# EAGLE design main_board (EAGLE 9.0.0)
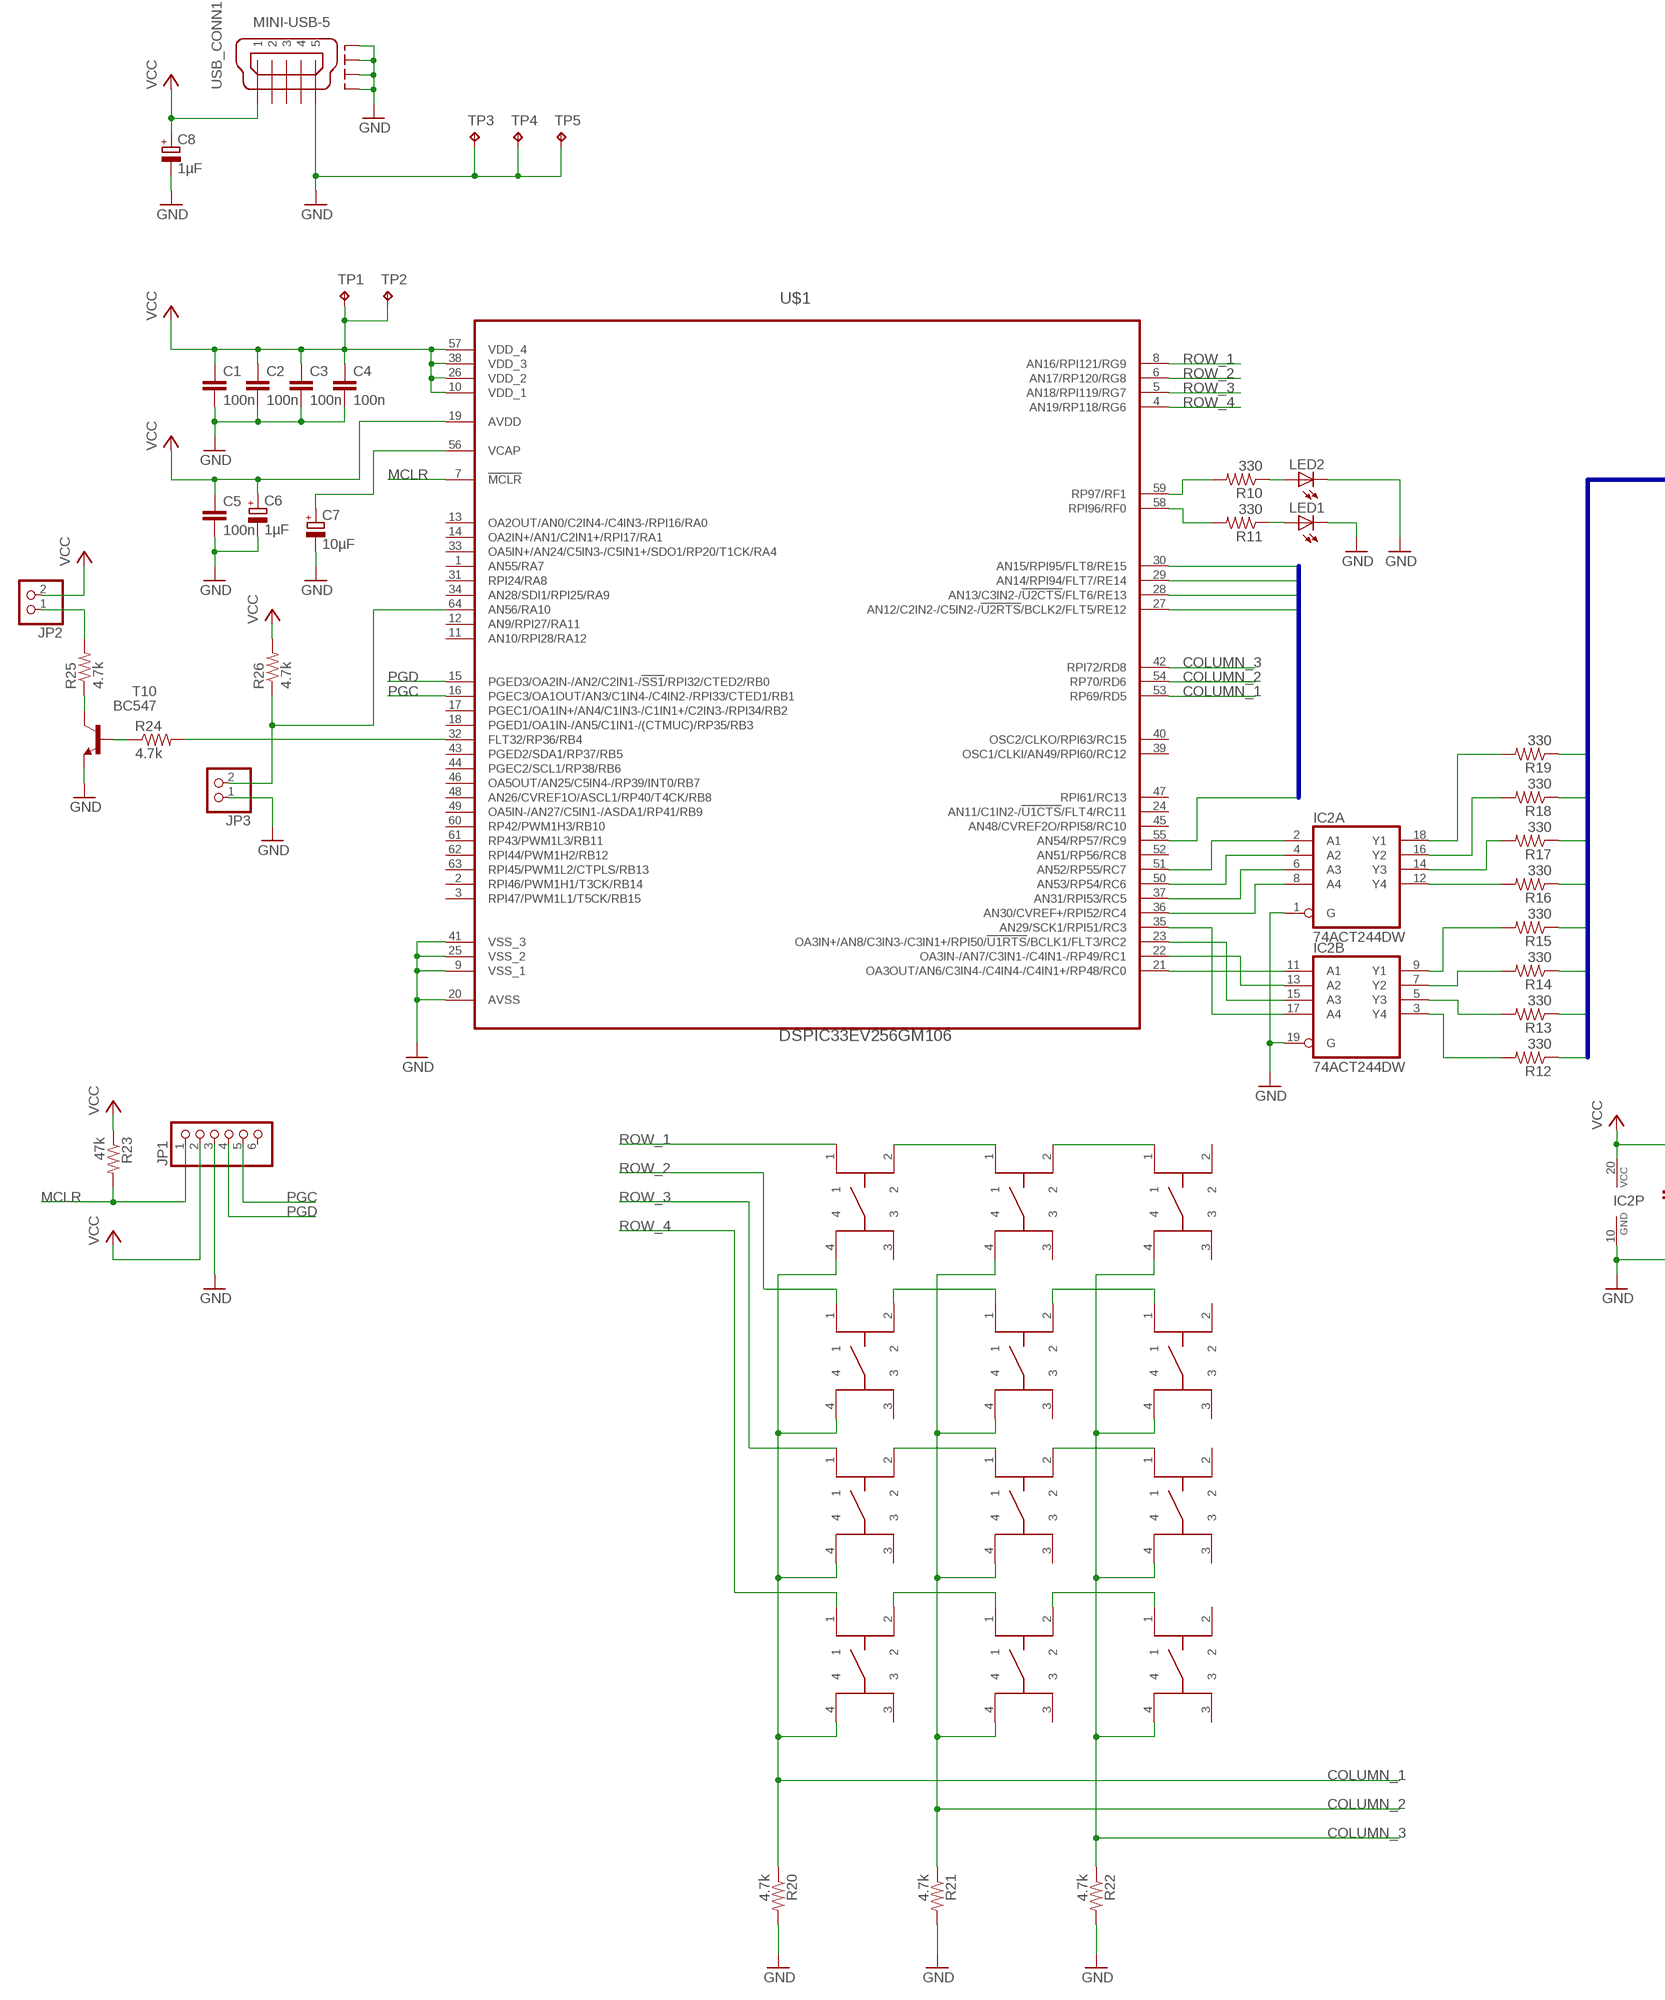
[diagram p0: schematic, sheet 1, part 1 of 2]
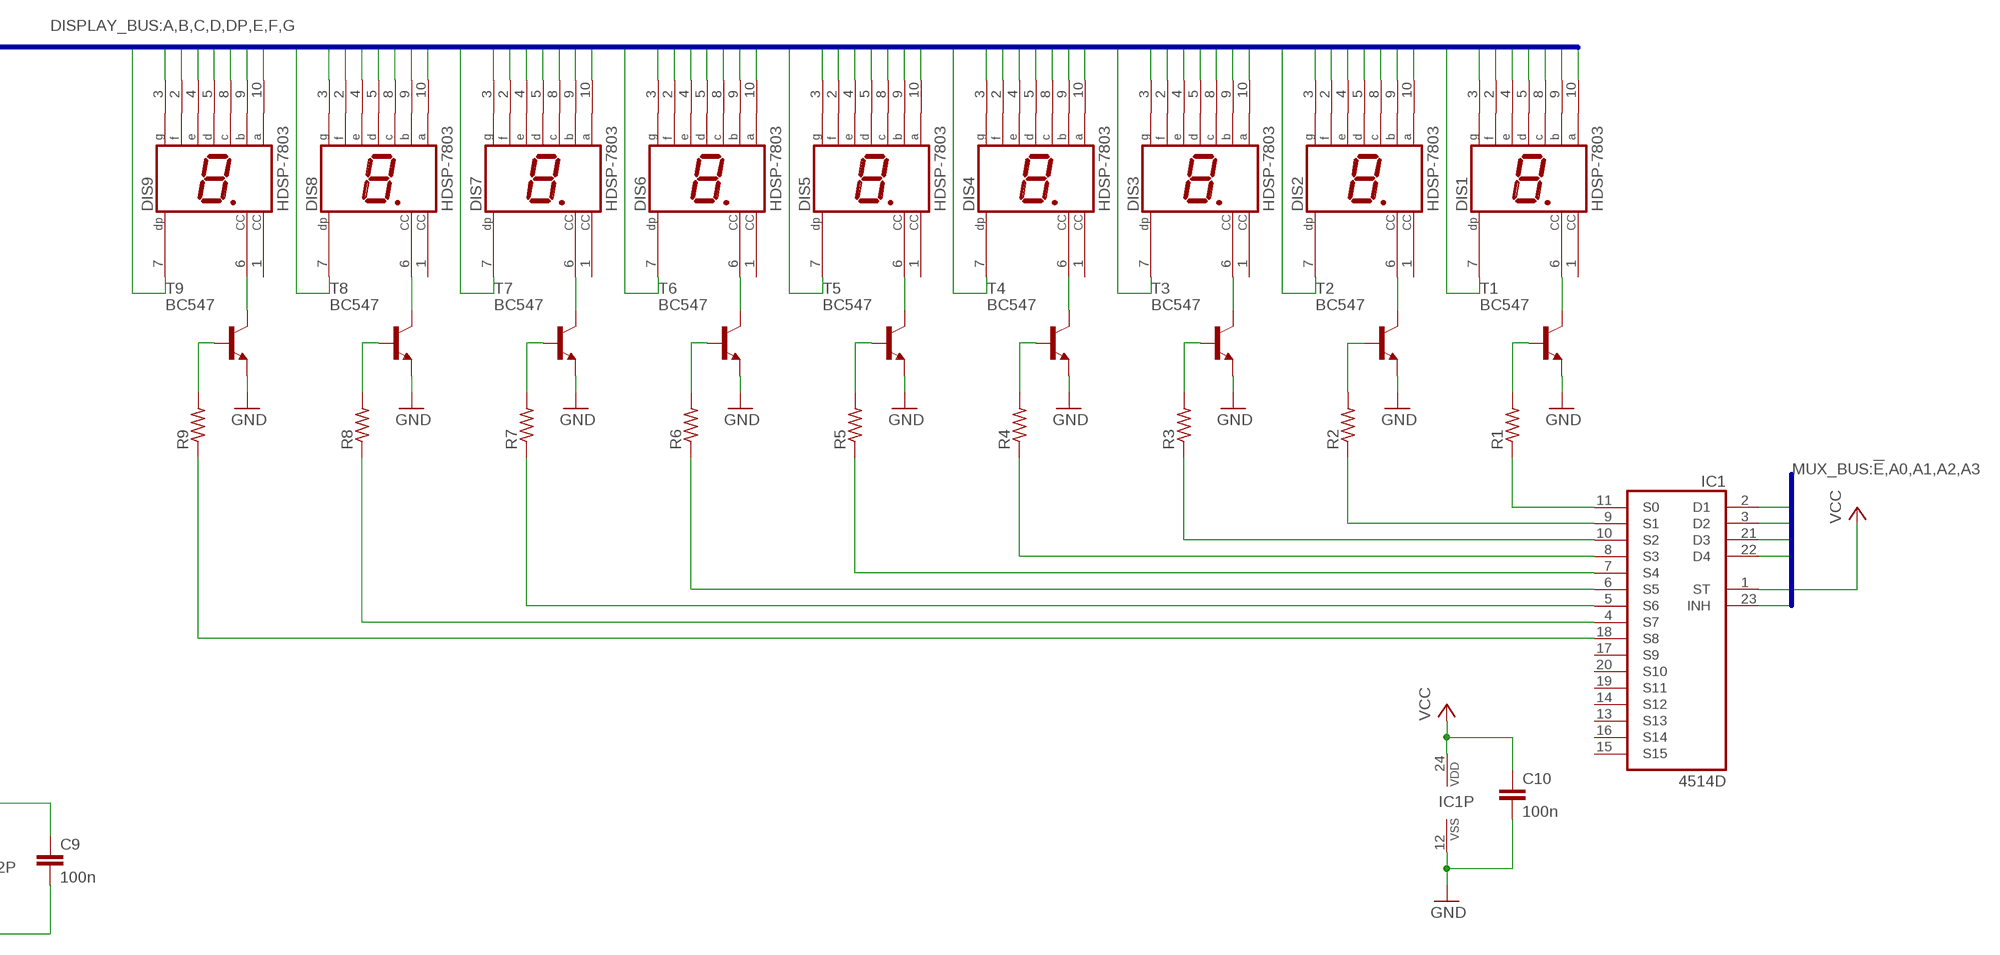
[diagram p1: schematic, sheet 1, part 2 of 2]

## Parts
B1  KSC521G  [KSC521G]
B2  KSC521G  [KSC521G]
B3  KSC521G  [KSC521G]
B4  KSC521G  [KSC521G]
B5  KSC521G  [KSC521G]
B6  KSC521G  [KSC521G]
B7  KSC521G  [KSC521G]
B8  KSC521G  [KSC521G]
B9  KSC521G  [KSC521G]
B10  KSC521G  [KSC521G]
B11  KSC521G  [KSC521G]
B12  KSC521G  [KSC521G]
C1  100n  C-EU050-025X075  [C050-025X075]
C2  100n  C-EU050-025X075  [C050-025X075]
C3  100n  C-EU050-025X075  [C050-025X075]
C4  100n  C-EU050-025X075  [C050-025X075]
C5  100n  C-EU050-025X075  [C050-025X075]
C6  1µF  CPOL-EUE2.5-7  [E2,5-7]
C7  10µF  CPOL-EUE2.5-7  [E2,5-7]
C8  1µF  CPOL-EUE2.5-7  [E2,5-7]
C9  100n  C-EU050-025X075  [C050-025X075]
C10  100n  C-EU050-025X075  [C050-025X075]
DIS1  HDSP-7803  [HDSP-A]
DIS2  HDSP-7803  [HDSP-A]
DIS3  HDSP-7803  [HDSP-A]
DIS4  HDSP-7803  [HDSP-A]
DIS5  HDSP-7803  [HDSP-A]
DIS6  HDSP-7803  [HDSP-A]
DIS7  HDSP-7803  [HDSP-A]
DIS8  HDSP-7803  [HDSP-A]
DIS9  HDSP-7803  [HDSP-A]
IC1  4514D  [SO24W]
IC2  74ACT244DW  [SO20W]
JP1  PINHD-1X6  [1X06]
JP2  PINHD-1X2  [1X02]
JP3  PINHD-1X2  [1X02]
LED1  LED5MM  [LED5MM]
LED2  LED5MM  [LED5MM]
R1  R-US_0207/10  [0207/10]
R2  R-US_0207/10  [0207/10]
R3  R-US_0207/10  [0207/10]
R4  R-US_0207/10  [0207/10]
R5  R-US_0207/10  [0207/10]
R6  R-US_0207/10  [0207/10]
R7  R-US_0207/10  [0207/10]
R8  R-US_0207/10  [0207/10]
R9  R-US_0207/10  [0207/10]
R10  330  R-US_0207/10  [0207/10]
R11  330  R-US_0207/10  [0207/10]
R12  330  R-US_0207/10  [0207/10]
R13  330  R-US_0207/10  [0207/10]
R14  330  R-US_0207/10  [0207/10]
R15  330  R-US_0207/10  [0207/10]
R16  330  R-US_0207/10  [0207/10]
R17  330  R-US_0207/10  [0207/10]
R18  330  R-US_0207/10  [0207/10]
R19  330  R-US_0207/10  [0207/10]
R20  4.7k  R-US_0207/10  [0207/10]
R21  4.7k  R-US_0207/10  [0207/10]
R22  4.7k  R-US_0207/10  [0207/10]
R23  47k  R-US_0207/10  [0207/10]
R24  4.7k  R-US_0207/10  [0207/10]
R25  4.7k  R-US_0207/10  [0207/10]
R26  4.7k  R-US_0207/10  [0207/10]
T1  BC547  [TO92]
T2  BC547  [TO92]
T3  BC547  [TO92]
T4  BC547  [TO92]
T5  BC547  [TO92]
T6  BC547  [TO92]
T7  BC547  [TO92]
T8  BC547  [TO92]
T9  BC547  [TO92]
T10  BC547  [TO92]
TP1  TPTP12SQ  [TP12SQ]
TP2  TPTP12SQ  [TP12SQ]
TP3  TPTP12SQ  [TP12SQ]
TP4  TPTP12SQ  [TP12SQ]
TP5  TPTP12SQ  [TP12SQ]
U$1  DSPIC33EV256GM106  [TQFP64-10X10]
USB_CONN1  MINI-USB-5  [56579-0579]

## Nets
!E: IC1.23(INH) U$1.55(AN54/RP57/RC9)
A: DIS1.10(A) DIS2.10(A) DIS3.10(A) DIS4.10(A) DIS5.10(A) DIS6.10(A) DIS7.10(A) DIS8.10(A) DIS9.10(A) R12.1
A0: IC1.2(D1) U$1.27(AN12/C2IN2-/C5IN2-/!U2RTS!/BCLK2/FLT5/RE12)
A1: IC1.3(D2) U$1.28(AN13/C3IN2-/!U2CTS!/FLT6/RE13)
A2: IC1.21(D3) U$1.29(AN14/RPI94/FLT7/RE14)
A3: IC1.22(D4) U$1.30(AN15/RPI95/FLT8/RE15)
B: DIS1.9(B) DIS2.9(B) DIS3.9(B) DIS4.9(B) DIS5.9(B) DIS6.9(B) DIS7.9(B) DIS8.9(B) DIS9.9(B) R13.1
C: DIS1.8(C) DIS2.8(C) DIS3.8(C) DIS4.8(C) DIS5.8(C) DIS6.8(C) DIS7.8(C) DIS8.8(C) DIS9.8(C) R14.1
COLUMN_1: B1.4 B4.4 B7.4 B11.4 R20.1 U$1.53(RP69/RD5)
COLUMN_2: B2.4 B5.4 B8.4 B10.4 R21.1 U$1.54(RP70/RD6)
COLUMN_3: B3.4 B6.4 B9.4 B12.4 R22.1 U$1.42(RPI72/RD8)
D: DIS1.5(D) DIS2.5(D) DIS3.5(D) DIS4.5(D) DIS5.5(D) DIS6.5(D) DIS7.5(D) DIS8.5(D) DIS9.5(D) R15.1
DP: DIS1.7(DP) DIS2.7(DP) DIS3.7(DP) DIS4.7(DP) DIS5.7(DP) DIS6.7(DP) DIS7.7(DP) DIS8.7(DP) DIS9.7(DP) R19.1
E: DIS1.4(E) DIS2.4(E) DIS3.4(E) DIS4.4(E) DIS5.4(E) DIS6.4(E) DIS7.4(E) DIS8.4(E) DIS9.4(E) R16.1
F: DIS1.2(F) DIS2.2(F) DIS3.2(F) DIS4.2(F) DIS5.2(F) DIS6.2(F) DIS7.2(F) DIS8.2(F) DIS9.2(F) R17.1
G: DIS1.3(G) DIS2.3(G) DIS3.3(G) DIS4.3(G) DIS5.3(G) DIS6.3(G) DIS7.3(G) DIS8.3(G) DIS9.3(G) R18.1
GND: C1.2 C2.2 C3.2 C4.2 C5.2 C6.- C7.- C8.- C9.2 C10.2 IC1.12(VSS) IC2.1(A:G) IC2.10(P:GND) IC2.19(B:G) JP1.3 JP3.1 LED1.K(C) LED2.K(C) R20.2 R21.2 R22.2 T1.1(E) T2.1(E) T3.1(E) T4.1(E) T5.1(E) T6.1(E) T7.1(E) T8.1(E) T9.1(E) T10.1(E) TP3.TP TP4.TP TP5.TP U$1.9(VSS_1) U$1.20(AVSS) U$1.25(VSS_2) U$1.41(VSS_3) USB_CONN1.GND USB_CONN1.SHIELD@1(S1) USB_CONN1.SHIELD@2(S2) USB_CONN1.SHIELD@3(S3) USB_CONN1.SHIELD@4(S4)
MCLR: JP1.1 R23.2 U$1.7(!MCLR)
N$1: DIS9.6(CC) T9.3(C)
N$2: C7.+ U$1.56(VCAP)
N$3: DIS8.6(CC) T8.3(C)
N$4: DIS7.6(CC) T7.3(C)
N$5: DIS6.6(CC) T6.3(C)
N$6: DIS5.6(CC) T5.3(C)
N$7: DIS4.6(CC) T4.3(C)
N$8: DIS3.6(CC) T3.3(C)
N$9: DIS2.6(CC) T2.3(C)
N$10: DIS1.6(CC) T1.3(C)
N$11: R1.2 T1.2(B)
N$12: R2.2 T2.2(B)
N$13: R3.2 T3.2(B)
N$14: R4.2 T4.2(B)
N$15: R5.2 T5.2(B)
N$16: R6.2 T6.2(B)
N$17: R7.2 T7.2(B)
N$18: R8.2 T8.2(B)
N$19: R9.2 T9.2(B)
N$20: IC1.11(S0) R1.1
N$21: IC1.9(S1) R2.1
N$22: IC1.10(S2) R3.1
N$23: IC1.8(S3) R4.1
N$24: IC1.7(S4) R5.1
N$25: IC1.6(S5) R6.1
N$26: IC1.5(S6) R7.1
N$27: IC1.4(S7) R8.1
N$28: IC1.18(S8) R9.1
N$29: R10.2 U$1.59(RP97/RF1)
N$30: IC2.3(B:Y4) R12.2
N$31: LED1.A R11.1
N$32: R11.2 U$1.58(RPI96/RF0)
N$33: LED2.A R10.1
N$34: IC2.17(B:A4) U$1.35(AN29/SCK1/RPI51/RC3)
N$35: IC2.15(B:A3) U$1.23(OA3IN+/AN8/C3IN3-/C3IN1+/RPI50/!U1RTS!/BCLK1/FLT3/RC2)
N$36: IC2.13(B:A2) U$1.22(OA3IN-/AN7/C3IN1-/C4IN1-/RP49/RC1)
N$37: IC2.11(B:A1) U$1.21(OA3OUT/AN6/C3IN4-/C4IN4-/C4IN1+/RP48/RC0)
N$38: IC2.8(A:A4) U$1.36(AN30/CVREF+/RPI52/RC4)
N$39: IC2.6(A:A3) U$1.37(AN31/RPI53/RC5)
N$40: IC2.4(A:A2) U$1.50(AN53/RP54/RC6)
N$41: IC2.2(A:A1) U$1.51(AN52/RP55/RC7)
N$42: IC2.5(B:Y3) R13.2
N$43: IC2.7(B:Y2) R14.2
N$44: IC2.9(B:Y1) R15.2
N$45: IC2.12(A:Y4) R16.2
N$46: IC2.14(A:Y3) R17.2
N$47: IC2.16(A:Y2) R18.2
N$48: IC2.18(A:Y1) R19.2
N$49: JP3.2 R26.1 U$1.64(AN56/RA10)
N$50: R24.1 T10.2(B)
N$51: R25.1 T10.3(C)
N$52: R24.2 U$1.32(FLT32/RP36/RB4)
N$53: JP2.1 R25.2
N$54: B7.2 B8.1
N$55: B1.2 B2.1
N$56: B2.2 B3.1
N$57: B4.2 B5.1
N$58: B5.2 B6.1
N$59: B8.2 B9.1
N$60: B10.1 B11.2
N$61: B10.2 B12.1
PGC: JP1.5 U$1.16(PGEC3/OA1OUT/AN3/C1IN4-/C4IN2-/RPI33/CTED1/RB1)
PGD: JP1.4 U$1.15(PGED3/OA2IN-/AN2/C2IN1-/!SS1!/RPI32/CTED2/RB0)
ROW_1: B1.1 U$1.8(AN16/RPI121/RG9)
ROW_2: B4.1 U$1.6(AN17/RP120/RG8)
ROW_3: B7.1 U$1.5(AN18/RPI119/RG7)
ROW_4: B11.1 U$1.4(AN19/RP118/RG6)
VCC: C1.1 C2.1 C3.1 C4.1 C5.1 C6.+ C8.+ C9.1 C10.1 IC1.1(ST) IC1.24(VDD) IC2.20(P:VCC) JP1.2 JP2.2 R23.1 R26.2 TP1.TP TP2.TP U$1.10(VDD_1) U$1.19(AVDD) U$1.26(VDD_2) U$1.38(VDD_3) U$1.57(VDD_4) USB_CONN1.VBUS
Unconnected: B1.3 B2.3 B3.2 B3.3 B4.3 B5.3 B6.2 B6.3 B7.3 B8.3 B9.2 B9.3 B10.3 B11.3 B12.2 B12.3 DIS1.1(CC) DIS2.1(CC) DIS3.1(CC) DIS4.1(CC) DIS5.1(CC) DIS6.1(CC) DIS7.1(CC) DIS8.1(CC) DIS9.1(CC) IC1.13(S13) IC1.14(S12) IC1.15(S15) IC1.16(S14) IC1.17(S9) IC1.19(S11) IC1.20(S10) JP1.6 U$1.1(AN55/RA7) U$1.2(RPI46/PWM1H1/T3CK/RB14) U$1.3(RPI47/PWM1L1/T5CK/RB15) U$1.11(AN10/RPI28/RA12) U$1.12(AN9/RPI27/RA11) U$1.13(OA2OUT/AN0/C2IN4-/C4IN3-/RPI16/RA0) U$1.14(OA2IN+/AN1/C2IN1+/RPI17/RA1) U$1.17(PGEC1/OA1IN+/AN4/C1IN3-/C1IN1+/C2IN3-/RPI34/RB2) U$1.18(PGED1/OA1IN-/AN5/C1IN1-/(CTMUC)/RP35/RB3) U$1.24(AN11/C1IN2-/!U1CTS!/FLT4/RC11) U$1.31(RPI24/RA8) U$1.33(OA5IN+/AN24/C5IN3-/C5IN1+/SDO1/RP20/T1CK/RA4) U$1.34(AN28/SDI1/RPI25/RA9) U$1.39(OSC1/CLKI/AN49/RPI60/RC12) U$1.40(OSC2/CLKO/RPI63/RC15) U$1.43(PGED2/SDA1/RP37/RB5) U$1.44(PGEC2/SCL1/RP38/RB6) U$1.45(AN48/CVREF2O/RPI58/RC10) U$1.46(OA5OUT/AN25/C5IN4-/RP39/INT0/RB7) U$1.47(RPI61/RC13) U$1.48(AN26/CVREF1O/ASCL1/RP40/T4CK/RB8) U$1.49(OA5IN-/AN27/C5IN1-/ASDA1/RP41/RB9) U$1.52(AN51/RP56/RC8) U$1.60(RP42/PWM1H3/RB10) U$1.61(RP43/PWM1L3/RB11) U$1.62(RPI44/PWM1H2/RB12) U$1.63(RPI45/PWM1L2/CTPLS/RB13) USB_CONN1.DN USB_CONN1.DP USB_CONN1.NC

## Buses
DISPLAY_BUS:A,B,C,D,DP,E,F,G
MUX_BUS:!E,A0,A1,A2,A3

## Library data of the parts
B1-B12 = qb_lib:KSC521G: KSC521G Boutton poussoir de C&K COMPONENTS. Référence Farnell : 2845724
C1-C5 C9 C10 = rcl:C-EU: CAPACITOR, European symbol; SPICEPREFIX: C
C6-C8 = rcl:CPOL-EU: POLARIZED CAPACITOR, European symbol; SPICEPREFIX: C
DIS1-DIS9 = qb_lib:HDSP-7803: LED DISPLAY 1-character 7 segment, decimal point right; OC_FARNELL: unknown; OC_NEWARK: unknown
IC1 = 45xx:4514: 4-bit latch 4-16 line DECODER
IC2 = 74xx-eu:74*244: Octal BUFFER and LINE DRIVER, 3-state
JP1 = pinhead:PINHD-1X6: PIN HEADER
JP2 JP3 = pinhead:PINHD-1X2: PIN HEADER
LED1 LED2 = led:LED: LED OSRAM: - CHIPLED LG R971, LG N971, LY N971, LG Q971, LY Q971, LO R971, LY R971 LH N974, LH R974 LS Q976, LO Q976, LY Q976 LO Q996 - Hyper CHIPLED LW Q18S LB Q993, LB Q99A, LB R99A - SideLED LS A670, LO A670, LY A670, LG A670, LP A670 LB A673, LV A673, LT A673, LW A673 LH A674 LY A675 LS A676, LA A676, LO A676, LY A676, LW A676 LS A679, LY A679, LG A679 - Hyper Micro SIDELED® LS Y876, LA Y876, LO Y876, LY Y876 LT Y87S - SmartLED LW L88C, LW L88S LB L89C, LB L89S, LG L890 LS L89K, LO L89K, LY L89K LS L896, LA L896, LO L896, LY L896 - TOPLED LS T670, LO T670, LY T670, LG T670, LP T670 LSG T670, LSP T670, LSY T670, LOP T670, LYG T670 LG T671, LOG T671, LSG T671 LB T673, LV T673, LT T673, LW T673 LH T674 LS T676, LA T676, LO T676, LY T676, LB T676, LH T676, LSB T676, LW T676 LB T67C, LV T67C, LT T67C, LS T67K, LO T67K, LY T67K, LW E67C LS E67B, LA E67B, LO E67B, LY E67B, LB E67C, LV E67C, LT E67C LW T67C LS T679, LY T679, LG T679 LS T770, LO T770, LY T770, LG T770, LP T770 LB T773, LV T773, LT T773, LW T773 LH T774 LS E675, LA E675, LY E675, LS T675 LS T776, LA T776, LO T776, LY T776, LB T776 LHGB T686 LT T68C, LB T68C - Hyper Mini TOPLED® LB M676 - Mini TOPLED Santana® LG M470 LS M47K, LO M47K, LY M47K Source: http://www.osram.convergy.de LUXEON: - LUMILED® LXK2-PW12-R00, LXK2-PW12-S00, LXK2-PW14-U00, LXK2-PW14-V00 LXK2-PM12-R00, LXK2-PM12-S00, LXK2-PM14-U00 LXK2-PE12-Q00, LXK2-PE12-R00, LXK2-PE12-S00, LXK2-PE14-T00, LXK2-PE14-U00 LXK2-PB12-K00, LXK2-PB12-L00, LXK2-PB12-M00, LXK2-PB14-N00, LXK2-PB14-P00, LXK2-PB14-Q00 LXK2-PR12-L00, LXK2-PR12-M00, LXK2-PR14-Q00, LXK2-PR14-R00 LXK2-PD12-Q00, LXK2-PD12-R00, LXK2-PD12-S00 LXK2-PH12-R00, LXK2-PH12-S00 LXK2-PL12-P00, LXK2-PL12-Q00, LXK2-PL12-R00 Source: www.luxeon.com KINGBRIGHT: KA-3528ASYC Source: www.kingbright.com
R1-R26 = rcl:R-US_: RESISTOR, American symbol; SPICEPREFIX: R
T1-T10 = transistor:BC547: NPN TRANSISTOR
TP1-TP5 = testpad:TP: Test pad
U$1 = disto_synth_lib:DSPIC33EV256GM106
USB_CONN1 = qb_lib:MINI-USB-5

## Board
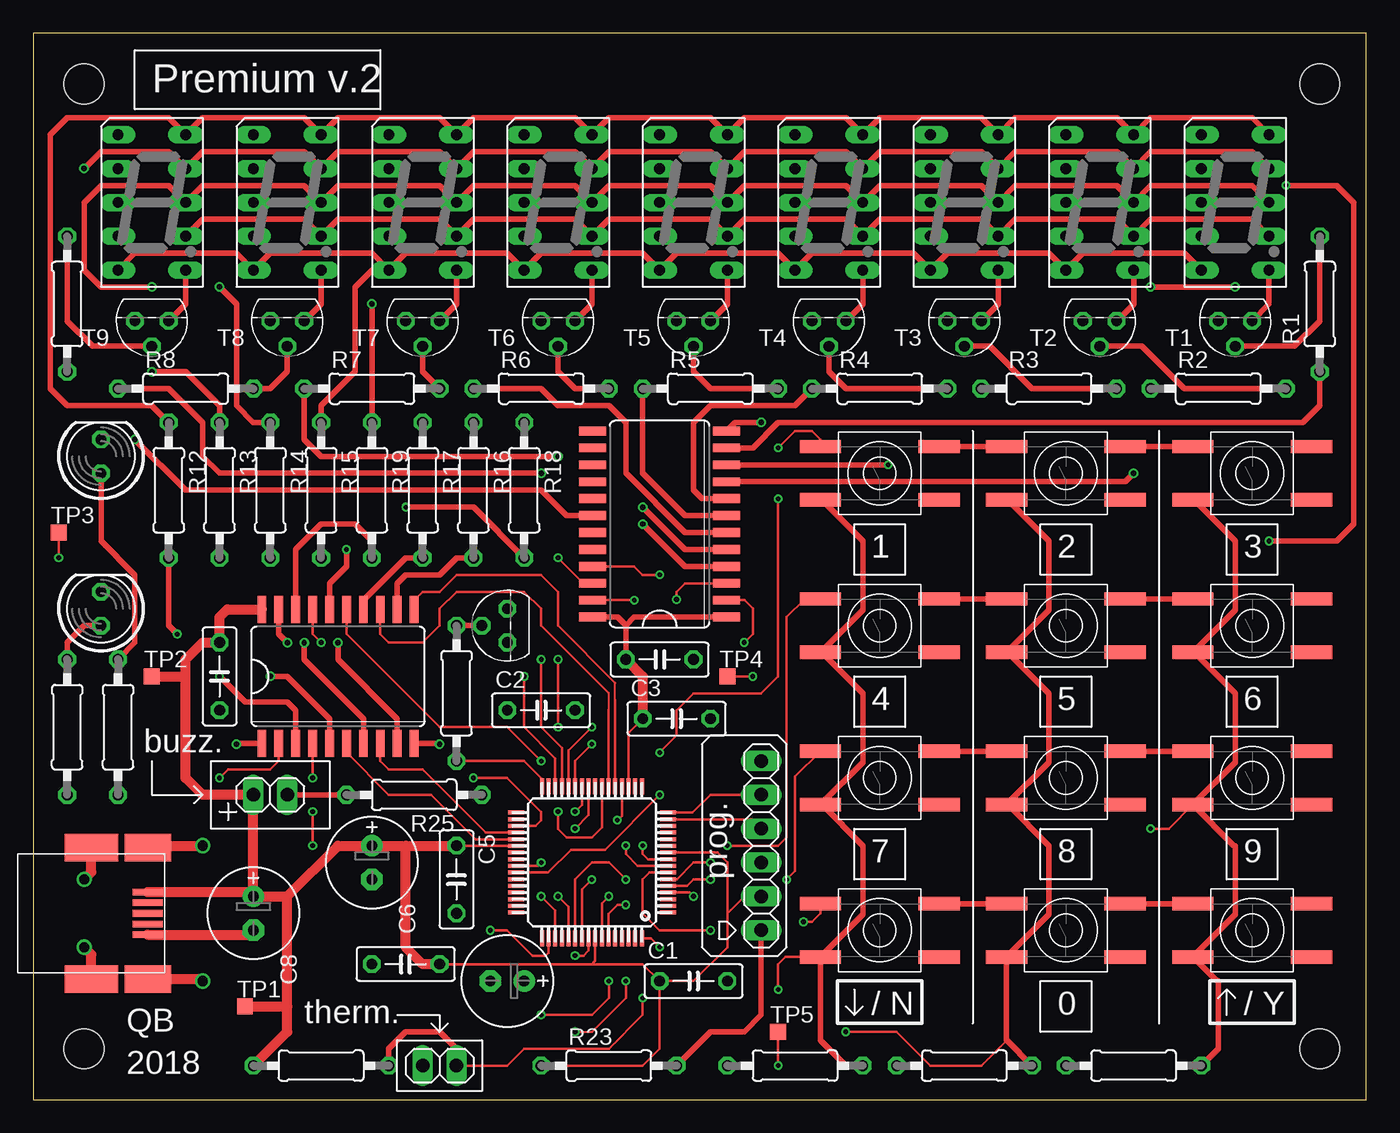
[diagram p2: board, top side]
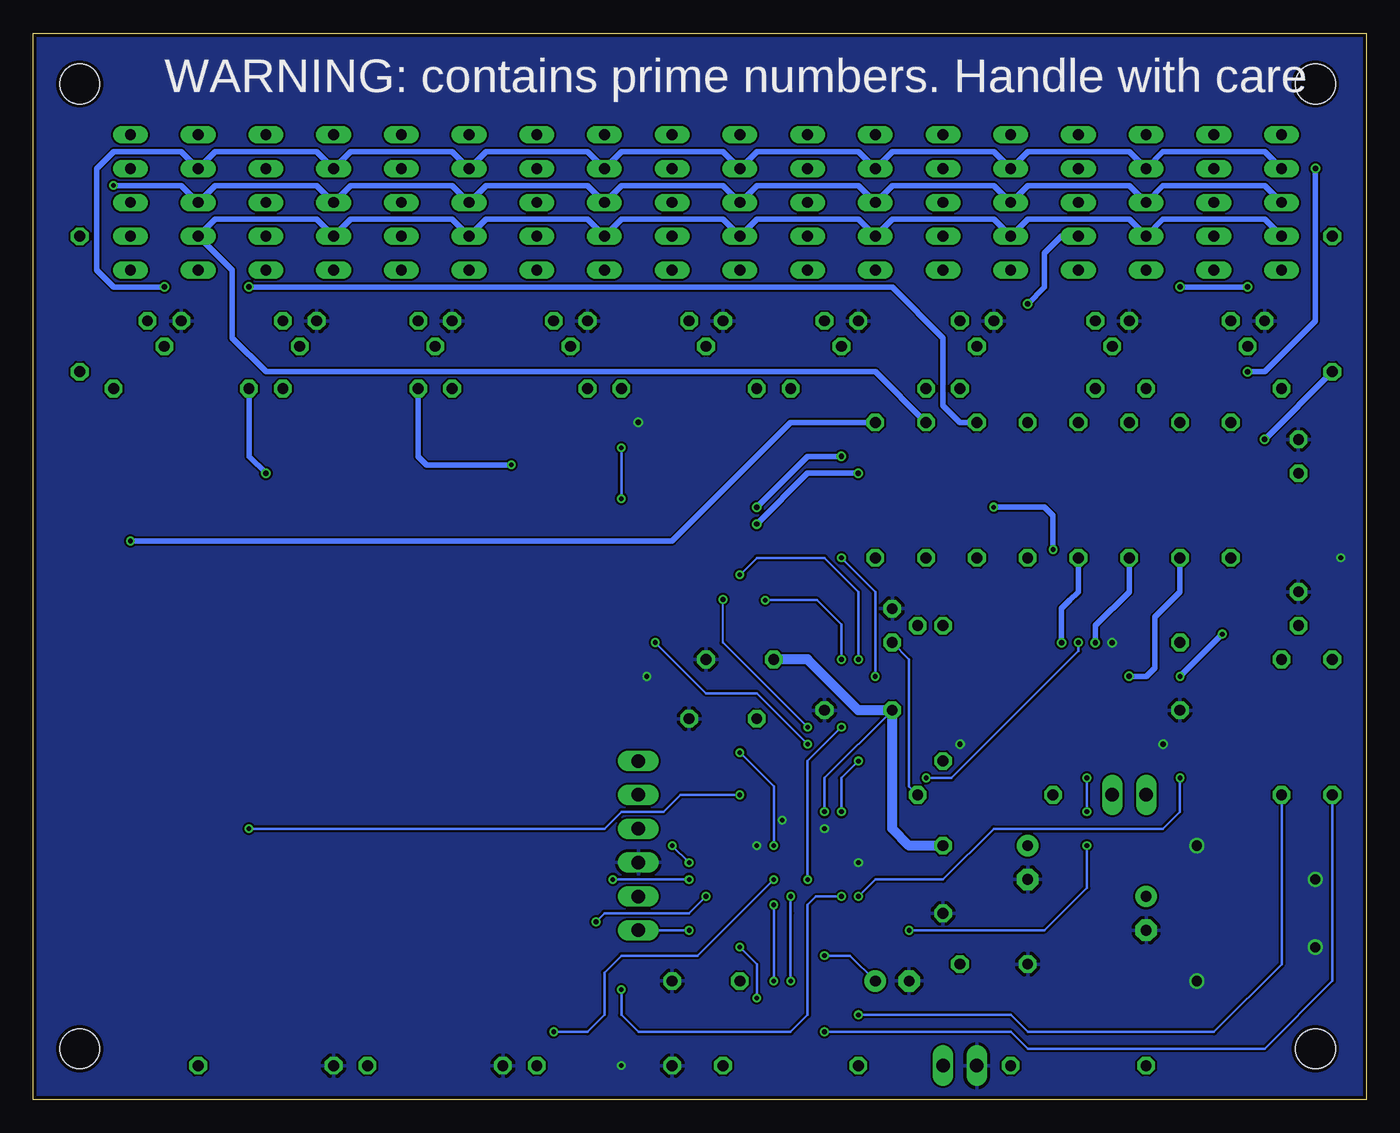
[diagram p3: board, bottom side, seen from below]

Size 100 x 80 mm. Coordinates in mm from the lower left corner, seen from the top.
Outline: 0,0 100,0 100,80 0,80 0,0
Copper layers (1*16): Top 0.035mm / dielectric 1.5mm / Bottom 0.035mm
Design rules "SeeedStudio_2layer_DRU_no_angle_20140221": minimum track width 6mil, minimum drill 12mil, track to track 6mil, track to pad 6mil, pad to pad 6mil, via to via 6mil, smd to smd 0mil, copper to edge 10mil, drill to drill 10mil, minimum pad ring 10mil, minimum via ring 6mil, stop-mask expansion 2mil, vias tented up to drill 100mil, thermal gap 10mil
Holes 3 mm at 3.81,76.2 96.52,76.2 3.81,3.81 96.52,3.81

### Footprints (pad centres in the part's own frame; a part is rotated, then mirrored left to right if it is on the bottom)
KSC521G = smd 3.1 x 1: 1 -4.45,2; 2 4.45,2; 3 4.45,-2; 4 -4.45,-2
C050-025X075 = drill 0.813 octagon: 1 -2.54,0; 2 2.54,0
E2,5-7 = drill 0.813 pad 1.6: + -1.27,0 | drill 0.813 pad 1.6 octagon: - 1.27,0
HDSP-A = drill 0.813 long: 1 -2.54,5.08; 2 -2.54,2.54; 3 -2.54,0; 4 -2.54,-2.54; 5 -2.54,-5.08; 6 2.54,-5.08; 7 2.54,-2.54; 8 2.54,0; 9 2.54,2.54; 10 2.54,5.08
SO24W = smd 0.66 x 2.032: 1 -6.985,-5.029; 2 -5.715,-5.029; 3 -4.445,-5.029; 4 -3.175,-5.029; 5 -1.905,-5.029; 6 -0.635,-5.029; 7 0.635,-5.029; 8 1.905,-5.029; 9 3.175,-5.029; 10 4.445,-5.029; 11 5.715,-5.029; 12 6.985,-5.029; 13 6.985,5.029; 14 5.715,5.029; 15 4.445,5.029; 16 3.175,5.029; 17 1.905,5.029; 18 0.635,5.029; 19 -0.635,5.029; 20 -1.905,5.029; 21 -3.175,5.029; 22 -4.445,5.029; 23 -5.715,5.029; 24 -6.985,5.029
SO20W = smd 0.66 x 2.032: 1 -5.715,-5.029; 2 -4.445,-5.029; 3 -3.175,-5.029; 4 -1.905,-5.029; 5 -0.635,-5.029; 6 0.635,-5.029; 7 1.905,-5.029; 8 3.175,-5.029; 9 4.445,-5.029; 10 5.715,-5.029; 11 5.715,5.029; 12 4.445,5.029; 13 3.175,5.029; 14 1.905,5.029; 15 0.635,5.029; 16 -0.635,5.029; 17 -1.905,5.029; 18 -3.175,5.029; 19 -4.445,5.029; 20 -5.715,5.029
1X06 = drill 1.016 long: 1 -6.35,0; 2 -3.81,0; 3 -1.27,0; 4 1.27,0; 5 3.81,0; 6 6.35,0
1X02 = drill 1.016 long: 1 -1.27,0; 2 1.27,0
LED5MM = drill 0.813 octagon: A -1.27,0; K 1.27,0
0207/10 = drill 0.813 octagon: 1 -5.08,0; 2 5.08,0
TO92 = drill 0.813 octagon: 1 1.27,0; 2 0,1.905; 3 -1.27,0
TP12SQ = smd 1.2 x 1.2: TP 0,0
TQFP64-10X10 = smd 1.2 x 0.3: 1 -5.7,3.75; 2 -5.7,3.25; 3 -5.7,2.75; 4 -5.7,2.25; 5 -5.7,1.75; 6 -5.7,1.25; 7 -5.7,0.75; 8 -5.7,0.25; 9 -5.7,-0.25; 10 -5.7,-0.75; 11 -5.7,-1.25; 12 -5.7,-1.75; 13 -5.7,-2.25; 14 -5.7,-2.75; 15 -5.7,-3.25; 16 -5.7,-3.75; 33 5.7,-3.75; 34 5.7,-3.25; 35 5.7,-2.75; 36 5.7,-2.25; 37 5.7,-1.75; 38 5.7,-1.25; 39 5.7,-0.75; 40 5.7,-0.25; 41 5.7,0.25; 42 5.7,0.75; 43 5.7,1.25; 44 5.7,1.75; 45 5.7,2.25; 46 5.7,2.75; 47 5.7,3.25; 48 5.7,3.75 | smd 0.3 x 1.2: 17 -3.75,-5.7; 18 -3.25,-5.7; 19 -2.75,-5.7; 20 -2.25,-5.7; 21 -1.75,-5.7; 22 -1.25,-5.7; 23 -0.75,-5.7; 24 -0.25,-5.7; 25 0.25,-5.7; 26 0.75,-5.7; 27 1.25,-5.7; 28 1.75,-5.7; 29 2.25,-5.7; 30 2.75,-5.7; 31 3.25,-5.7; 32 3.75,-5.7; 49 3.75,5.7; 50 3.25,5.7; 51 2.75,5.7; 52 2.25,5.7; 53 1.75,5.7; 54 1.25,5.7; 55 0.75,5.7; 56 0.25,5.7; 57 -0.25,5.7; 58 -0.75,5.7; 59 -1.25,5.7; 60 -1.75,5.7; 61 -2.25,5.7; 62 -2.75,5.7; 63 -3.25,5.7; 64 -3.75,5.7
56579-0579 = smd 2.25 x 0.5: DN 2.225,0.8; DP 2.225,0; GND 2.225,-1.6; NC 2.225,-0.8; VBUS 2.225,1.6 | smd 4 x 2.05: SHIELD@1 -2,4.925; SHIELD@4 -2,-4.925 | smd 3.5 x 2.05: SHIELD@2 2.25,4.925; SHIELD@3 2.25,-4.925

### Placement (x,y rotation side)
B1  63.5,46.99 0 top
B2  77.47,46.99 0 top
B3  91.44,46.99 0 top
B4  63.5,35.56 0 top
B5  77.47,35.56 0 top
B6  91.44,35.56 0 top
B7  63.5,24.13 0 top
B8  77.47,24.13 0 top
B9  91.44,24.13 0 top
B10  77.47,12.7 0 top
B11  63.5,12.7 0 top
B12  91.44,12.7 0 top
C1  49.53,8.89 0 top
C2  38.1,29.21 0 top
C3  48.26,28.57 0 top
C4  27.94,10.16 180 top
C5  31.75,16.51 270 top
C6  25.4,17.78 270 top
C7  35.56,8.89 180 top
C8  16.51,13.97 270 top
C9  13.97,31.75 270 top
C10  46.99,33.02 0 top
DIS1  90.17,67.31 0 top
DIS2  80.01,67.31 0 top
DIS3  69.85,67.31 0 top
DIS4  59.69,67.31 0 top
DIS5  49.53,67.31 0 top
DIS6  39.37,67.31 0 top
DIS7  29.21,67.31 0 top
DIS8  19.05,67.31 0 top
DIS9  8.89,67.31 0 top
IC1  46.99,43.18 90 top
IC2  22.86,31.75 0 top
JP1  54.61,19.05 90 top
JP2  17.78,22.86 180 top
JP3  30.48,2.54 0 top
LED1  5.08,48.26 90 top
LED2  5.08,36.83 90 top
R1  96.52,59.69 90 top
R2  88.9,53.34 0 top
R3  76.2,53.34 0 top
R4  63.5,53.34 0 top
R5  50.8,53.34 0 top
R6  38.1,53.34 0 top
R7  25.4,53.34 0 top
R8  11.43,53.34 0 top
R9  2.54,59.69 90 top
R10  2.54,27.94 270 top
R11  6.35,27.94 270 top
R12  10.16,45.72 270 top
R13  13.97,45.72 270 top
R14  17.78,45.72 270 top
R15  21.59,45.72 270 top
R16  33.02,45.72 270 top
R17  29.21,45.72 270 top
R18  36.83,45.72 270 top
R19  25.4,45.72 270 top
R20  57.15,2.54 180 top
R21  69.85,2.54 180 top
R22  82.55,2.54 180 top
R23  43.18,2.54 0 top
R24  31.75,30.48 270 top
R25  28.57,22.86 180 top
R26  21.59,2.54 180 top
T1  90.17,58.42 180 top
T2  80.01,58.42 180 top
T3  69.85,58.42 180 top
T4  59.69,58.42 180 top
T5  49.53,58.42 180 top
T6  39.37,58.42 180 top
T7  29.21,58.42 180 top
T8  19.05,58.42 180 top
T9  8.89,58.42 180 top
T10  35.56,35.56 90 top
TP1  15.88,6.99 0 top
TP2  8.89,31.75 0 top
TP3  1.91,42.55 0 top
TP4  52.07,31.75 0 top
TP5  55.88,5.08 0 top
U$1  41.91,17.78 180 top
USB_CONN1  6.35,13.97 0 top

### Tracks (layer width: path | path; a pad name or v marks a point on that pad's centre or on a via)
!E  (via drill 0.35)
  Top 0.203: v39.37,33.02 v39.37,27.94 | v41.91,16.51 41.16,15.76 U$1.55 | v45.09,37.47 IC1.23
  Bottom 0.203: v39.37,33.02 39.37,35.63 41.21,37.47 v45.09,37.47 | v39.37,27.94 41.91,25.4 v41.91,16.51
A
  Top 0.406: DIS1.10 91.44,73.66 83.82,73.66 DIS2.10 81.28,73.66 73.66,73.66 DIS3.10 71.12,73.66 63.5,73.66 DIS4.10 60.96,73.66 53.34,73.66 DIS5.10 50.8,73.66 43.18,73.66 DIS6.10 40.64,73.66 33.02,73.66 DIS7.10 30.48,73.66 22.86,73.66 DIS8.10 20.32,73.66 12.7,73.66 DIS9.10 10.16,73.66 2.54,73.66 1.27,72.39 1.27,53.34 2.54,52.07 8.89,52.07 R12.1
A0  (via drill 0.35)
  Top 0.203: U$1.27 40.66,25.38 40.64,25.4 v41.91,26.67 | v53.34,34.29 53.98,34.92 53.98,36.83 53.34,37.47 IC1.2
  Bottom 0.203: v41.91,26.67 45.72,30.48 49.53,30.48 v53.34,34.29
A1  (via drill 0.35)
  Top 0.203: U$1.28 40.16,26.19 v41.91,27.94 | v48.26,37.51 48.26,38.1 48.9,38.73 IC1.3
  Bottom 0.152: 48.26,34.29 v48.26,37.51
  Bottom 0.203: v41.91,27.94 48.26,34.29
A2  (via drill 0.35)
  Top 0.203: U$1.29 39.66,26.38 38.1,27.94 v38.1,33.02 | v46.99,39.37 45.72,39.37 45.09,40.01 IC1.21
  Bottom 0.203: v38.1,33.02 38.1,38.1 40.64,40.64 45.72,40.64 v46.99,39.37
A3  (via drill 0.35)
  Top 0.152: 41.27,38.73 IC1.22
  Top 0.203: U$1.30 39.16,25.61 36.83,27.94 v36.83,31.75 | v39.37,40.64 41.27,38.73
  Bottom 0.203: v39.37,40.64 36.83,38.1 v36.83,31.75
B  (via drill 0.41)
  Top 0.406: DIS1.9 91.44,71.12 83.82,71.12 DIS2.9 81.28,71.12 73.66,71.12 DIS3.9 71.12,71.12 63.5,71.12 DIS4.9 60.96,71.12 53.34,71.12 DIS5.9 50.8,71.12 43.18,71.12 DIS6.9 40.64,71.12 33.02,71.12 DIS7.9 30.48,71.12 22.86,71.12 DIS8.9 20.32,71.12 12.7,71.12 DIS9.9 10.16,71.12 5.08,71.12 v3.81,69.85 | R13.1 13.97,52.07 11.43,54.61 v8.89,54.61
  Bottom 0.406: v8.89,54.61 7.62,54.61 3.81,58.42 v3.81,69.85
C  (via drill 0.41)
  Top 0.406: DIS1.8 91.44,68.58 83.82,68.58 DIS2.8 81.28,68.58 73.66,68.58 DIS3.8 71.12,68.58 63.5,68.58 DIS4.8 60.96,68.58 53.34,68.58 DIS5.8 50.8,68.58 43.18,68.58 DIS6.8 40.64,68.58 33.02,68.58 DIS7.8 30.48,68.58 22.86,68.58 DIS8.8 20.32,68.58 12.7,68.58 DIS9.8 10.16,68.58 5.08,68.58 3.81,67.31 3.81,62.23 5.08,60.96 v8.89,60.96 | R14.1 16.51,50.8 15.24,52.07 15.24,59.69 v13.97,60.96
  Bottom 0.406: v8.89,60.96 v13.97,60.96
COLUMN_1  (via drill 0.35)
  Top 0.203: B11.4 56.42,10.7 55.88,10.16 v55.88,8.26 | U$1.53 40.16,14.45 v39.37,15.24
  Top 0.406: R20.1 60.96,2.54 59.05,4.45 B11.4 62.23,13.88 62.23,19.05 59.15,22.13 B7.4 62.23,25.31 62.23,30.48 59.15,33.56 B4.4 62.23,36.74 62.23,41.91 59.15,44.99 B1.4
  Bottom 0.203: v55.88,8.26 55.88,6.35 54.61,5.08 43.18,5.08 41.91,6.35 41.91,14.61 41.27,15.24 v39.37,15.24
COLUMN_2  (via drill 0.35)
  Top 0.203: 73.03,4.45 71.12,2.54 67.31,2.54 64.77,5.08 v60.96,5.08 | v44.45,16.51 43.18,17.78 41.91,17.78 40.66,16.53 U$1.54
  Top 0.406: R21.1 73.03,4.45 73.02,4.45 B10.4 76.2,13.88 76.2,19.05 73.12,22.13 B8.4 76.2,25.31 76.2,30.48 73.12,33.56 B5.4 76.2,36.74 76.2,41.91 73.12,44.99 B2.4
  Bottom 0.203: v60.96,5.08 58.42,5.08 57.15,6.35 57.15,9.53 55.88,10.79 50.16,10.79 v44.45,16.51
COLUMN_3  (via drill 0.35)
  Top 0.203: v83.82,20.32 85.18,20.32 B9.4 | U$1.42 38.62,17.03 40.34,18.75 42.88,18.75 v46.99,22.86
  Top 0.406: R22.1 88.9,3.81 88.9,8.89 88.8,8.89 B12.4 90.17,13.88 90.17,19.05 90.07,19.05 B9.4 90.17,25.31 90.17,30.48 87.09,33.56 B6.4 90.17,36.74 90.17,41.91 87.09,44.99 B3.4
  Bottom 0.203: v83.82,20.32 57.15,20.32 55.88,21.59 52.7,21.59 51.44,22.86 v46.99,22.86
D
  Top 0.406: DIS9.5 7.62,63.5 15.24,63.5 DIS8.5 17.78,63.5 25.4,63.5 DIS7.5 | DIS7.5 27.94,63.5 35.56,63.5 DIS6.5 38.1,63.5 45.72,63.5 DIS5.5 48.26,63.5 55.88,63.5 DIS4.5 58.42,63.5 66.04,63.5 DIS3.5 68.58,63.5 76.2,63.5 DIS2.5 78.74,63.5 86.36,63.5 DIS1.5 | R15.1 21.59,52.07 24.13,54.61 24.13,60.96 25.4,62.23 DIS7.5
DP  (via drill 0.41)
  Top 0.406: DIS9.7 12.7,66.04 20.32,66.04 DIS8.7 22.86,66.04 30.48,66.04 DIS7.7 33.02,66.04 40.64,66.04 DIS6.7 43.18,66.04 50.8,66.04 DIS5.7 53.34,66.04 60.96,66.04 DIS4.7 63.5,66.04 71.12,66.04 DIS3.7 73.66,66.04 81.28,66.04 DIS2.7 83.82,66.04 91.44,66.04 DIS1.7 | R19.1 v25.4,59.69
  Bottom 0.406: v25.4,59.69 24.13,60.96 24.13,63.5 22.86,64.77 DIS8.7
E
  Bottom 0.406: DIS9.4 7.62,66.04 15.24,66.04 DIS8.4 17.78,66.04 25.4,66.04 DIS7.4 27.94,66.04 35.56,66.04 DIS6.4 38.1,66.04 45.72,66.04 DIS5.4 48.26,66.04 55.88,66.04 DIS4.4 58.42,66.04 66.04,66.04 DIS3.4 68.58,66.04 76.2,66.04 DIS2.4 78.74,66.04 86.36,66.04 DIS1.4 85.09,62.23 85.09,57.15 82.55,54.61 36.83,54.61 R16.1
F  (via drill 0.41 pad 0.51)
  Top 0.406: v83.82,60.96 v90.17,60.96
  Bottom 0.406: DIS9.2 7.62,71.12 15.24,71.12 DIS8.2 17.78,71.12 25.4,71.12 DIS7.2 27.94,71.12 35.56,71.12 DIS6.2 38.1,71.12 45.72,71.12 DIS5.2 48.26,71.12 55.88,71.12 DIS4.2 58.42,71.12 66.04,71.12 DIS3.2 68.58,71.12 76.2,71.12 DIS2.2 78.74,71.12 86.36,71.12 DIS1.2 88.9,71.12 93.98,71.12 95.25,69.85 95.25,62.23 93.98,60.96 v90.17,60.96 | R17.1 30.48,50.8 31.75,52.07 31.75,57.15 35.56,60.96 v83.82,60.96
G  (via drill 0.35)
  Top 0.406: v92.71,41.91 97.79,41.91 99.06,43.18 99.06,67.31 97.79,68.58 v93.98,68.58
  Bottom 0.406: DIS9.3 7.62,68.58 15.24,68.58 DIS8.3 17.78,68.58 25.4,68.58 DIS7.3 27.94,68.58 35.56,68.58 DIS6.3 38.1,68.58 45.72,68.58 DIS5.3 48.26,68.58 55.88,68.58 DIS4.3 58.42,68.58 66.04,68.58 DIS3.3 68.58,68.58 76.2,68.58 DIS2.3 78.74,68.58 86.36,68.58 DIS1.3 88.9,68.58 v93.98,68.58 | R18.1 43.18,50.8 52.07,41.91 v92.71,41.91
GND  (via drill 0.35, 0.41, 0.76)
  Top 0.152: 41.66,22.61 41.66,22.86 U$1.25
  Top 0.203: U$1.20 44.16,21.3 v43.81,20.95 | v38.1,17.78 37.85,17.53 U$1.41 | U$1.9 46.1,18.03 45.72,18.41 v45.72,19.05 | 41.66,22.86 41.66,21.34 v40.64,20.32 | v53.98,31.75 TP4.TP | TP3.TP v1.91,40.64 | TP5.TP v55.88,2.54
  Top 0.406: IC1.12 52.65,50.8 v54.61,50.8 | v15.24,26.67 15.29,26.72 IC2.1 | v19.05,34.29 18.41,34.92 IC2.19 | v30.48,26.67 30.43,26.72 IC2.10
  Top 0.762: v3.81,16.51 4.35,17.05 USB_CONN1.SHIELD@1 | USB_CONN1.SHIELD@2 8.76,19.05 v12.7,19.05 | USB_CONN1.SHIELD@3 12.54,9.04 v12.7,8.89 | USB_CONN1.SHIELD@4 4.35,10.89 v3.81,11.43 | USB_CONN1.GND 16.18,12.37 C8.-
  pour Bottom: 0,80.01 100.33,80.01 100.33,0 0,0
MCLR  (via drill 0.35)
  Top 0.203: v50.8,12.7 46.99,12.7 45.72,13.97 45.72,16.51 46.24,17.03 U$1.7
  Top 0.406: R23.2 50.8,5.08 53.34,5.08 54.61,6.35 JP1.1
  Bottom 0.203: JP1.1 v50.8,12.7
N$1
  Top 0.406: T9.3 11.43,59.69 DIS9.6
N$2  (via drill 0.35)
  Top 0.203: v40.64,10.79 41.27,10.79 41.66,11.18 U$1.56
  Bottom 0.203: C7.+ 38.73,10.79 v40.64,10.79
N$3
  Top 0.406: T8.3 21.59,59.69 DIS8.6
N$4
  Top 0.406: T7.3 31.75,59.69 DIS7.6
N$5
  Top 0.406: T6.3 41.91,59.69 DIS6.6
N$6
  Top 0.406: T5.3 52.07,59.69 DIS5.6
N$7
  Top 0.406: T4.3 62.23,59.69 DIS4.6
N$8
  Top 0.406: T3.3 72.39,59.69 DIS3.6
N$9
  Top 0.406: T2.3 82.55,59.69 DIS2.6
N$10
  Top 0.406: T1.3 92.71,59.69 DIS1.6
N$11
  Top 0.406: T1.2 94.61,56.52 96.52,58.42 R1.2
N$12
  Top 0.406: R2.2 86.36,53.34 83.19,56.52 T2.2
N$13
  Top 0.406: R3.2 74.93,53.34 71.75,56.52 T3.2
N$14
  Top 0.406: R4.2 60.96,53.34 59.69,54.61 T4.2
N$15
  Top 0.406: R5.2 50.8,53.34 49.53,54.61 T5.2
N$16
  Top 0.406: R6.2 40.64,53.34 39.37,54.61 T6.2
N$17
  Top 0.406: R7.2 29.21,54.61 T7.2
N$18
  Top 0.406: R8.2 17.78,53.34 19.05,54.61 T8.2
N$19
  Top 0.406: T9.2 4.45,56.52 2.54,58.42 R9.2
N$20
  Top 0.406: IC1.11 53.98,48.9 55.88,50.8 95.25,50.8 96.52,52.07 R1.1
N$21  (via drill 0.41)
  Top 0.406: IC1.9 81.92,46.35 v82.55,46.99
  Bottom 0.406: v82.55,46.99 83.82,48.26 R2.1
N$22  (via drill 0.35)
  Top 0.406: IC1.10 v64.14,47.62
  Bottom 0.406: v64.14,47.62 70.48,47.62 71.12,48.26 R3.1
N$23
  Top 0.406: IC1.8 50.16,45.09 49.53,45.72 49.53,50.8 50.8,52.07 57.15,52.07 R4.1
N$24
  Top 0.406: IC1.7 48.9,43.81 45.72,46.99 45.72,48.26 R5.1
N$25
  Top 0.406: IC1.6 48.9,42.55 44.45,46.99 44.45,50.8 43.18,52.07 39.37,52.07 38.1,53.34 R6.1
N$26  (via drill 0.41 pad 0.51)
  Top 0.406: IC1.5 48.9,41.27 v45.72,44.45 | v39.37,48.26 21.59,48.26 20.32,49.53 R7.1
  Bottom 0.406: v45.72,44.45 41.91,48.26 v39.37,48.26
N$27  (via drill 0.41 pad 0.51)
  Top 0.406: IC1.4 48.9,40.01 v45.72,43.18 | v38.1,46.99 13.97,46.99 12.7,48.26 12.7,50.8 10.16,53.34 R8.1
  Bottom 0.406: v45.72,43.18 41.91,46.99 v38.1,46.99
N$28  (via drill 0.41 pad 0.51)
  Top 0.406: IC1.18 40.01,43.81 38.1,45.72 11.43,45.72 v7.62,49.53
  Bottom 0.406: v7.62,49.53 R9.1
N$29  (via drill 0.35)
  Top 0.152: v40.64,5.08 41.91,5.08
  Top 0.203: v44.45,8.89 44.45,7.62 41.91,5.08 | U$1.59 43.16,13.95 43.81,14.61 v44.45,14.61
  Bottom 0.203: R10.2 2.54,8.89 7.62,3.81 25.4,3.81 26.67,5.08 v40.64,5.08 | v44.45,8.89 v44.45,14.61
N$30  (via drill 0.35)
  Top 0.406: R12.2 10.16,35.56 v10.79,34.92 | v13.97,31.75 15.88,29.84 19.05,29.84 19.68,29.21 IC2.3
  Bottom 0.406: v13.97,31.75 v10.79,34.92
N$31
  Top 0.406: R11.1 7.62,34.29 7.62,39.37 5.08,41.91 LED1.A
N$32  (via drill 0.35)
  Top 0.203: v38.1,6.35 41.91,6.35 43.18,7.62 v43.18,8.89 | U$1.58 42.66,14.72 v43.18,15.24
  Bottom 0.203: R11.2 6.35,10.16 11.43,5.08 25.4,5.08 26.67,6.35 v38.1,6.35 | v43.18,8.89 43.18,13.97 v43.18,15.24
N$33
  Top 0.406: R10.1 2.54,34.29 3.81,35.56 LED2.A
N$34  (via drill 0.35)
  Top 0.203: v21.59,34.29 20.95,34.92 IC2.17 | U$1.35 37.67,20.53 38.1,20.95 38.1,21.59 35.56,24.13 v33.02,24.13
  Bottom 0.203: v21.59,34.29 21.59,33.66 31.11,24.13 v33.02,24.13
N$35  (via drill 0.35)
  Top 0.203: IC2.15 23.5,34.92 30.48,27.94 35.56,27.94 v38.1,25.4 | U$1.23 42.66,20.43 41.91,19.68 40.01,19.68 39.37,20.32 v39.37,21.59
  Bottom 0.203: v38.1,25.4 39.37,24.13 v39.37,21.59
N$36
  Top 0.152: 43.16,30.5 43.16,29.21
  Top 0.203: 43.16,29.23 43.16,29.21 U$1.22 | IC2.13 26.04,34.92 26.67,34.29 29.21,34.29 30.48,35.56 30.48,36.83 31.75,38.1 36.83,38.1 38.1,36.83 38.1,35.56 43.16,30.5
N$37
  Top 0.152: 43.66,30 43.66,31.27 | 28.57,37.47 IC2.11
  Top 0.203: U$1.21 43.66,30 | 28.57,37.47 29.21,38.1 30.48,38.1 31.75,39.37 38.1,39.37 39.37,38.1 39.37,35.56 43.66,31.27
N$38
  Top 0.203: 26.04,26.04 IC2.8 26.04,25.4 26.67,24.77 29.21,24.77 33.95,20.03 U$1.36
N$39
  Top 0.203: IC2.6 23.5,26.04 26.67,22.86 29.84,22.86 33.17,19.53 U$1.37
N$40  (via drill 0.35)
  Top 0.203: v34.29,12.7 35.56,12.7 37.47,10.79 38.43,10.79 38.66,11.03 U$1.50 | v20.95,19.05 v20.95,21.59 | v20.95,24.13 IC2.4
  Bottom 0.203: v34.29,12.7 24.13,12.7 20.95,15.88 v20.95,19.05 | v20.95,21.59 v20.95,24.13
N$41  (via drill 0.35)
  Top 0.152: U$1.51 39.16,12.91
  Top 0.203: v38.1,15.24 39.16,14.18 39.16,12.91 | v13.97,24.13 14.61,24.77 17.78,24.77 18.41,25.4 IC2.2
  Bottom 0.203: v13.97,24.13 13.97,21.59 15.24,20.32 27.94,20.32 31.75,16.51 36.83,16.51 v38.1,15.24
N$42  (via drill 0.41 pad 0.51)
  Top 0.406: IC2.5 22.23,28.57 19.05,31.75 v17.78,31.75
  Bottom 0.406: v17.78,31.75 16.51,31.75 15.88,32.38 15.88,36.2 13.97,38.1 R13.2
N$43  (via drill 0.41 pad 0.51)
  Top 0.406: IC2.7 24.77,28.57 20.32,33.02 v20.32,34.29
  Bottom 0.406: v20.32,34.29 20.32,35.56 17.78,38.1 R14.2
N$44  (via drill 0.41 pad 0.51)
  Top 0.406: IC2.9 27.3,28.57 22.86,33.02 v22.86,34.29
  Bottom 0.406: v22.86,34.29 22.86,36.83 22.23,37.47 21.59,38.1 R15.2
N$45
  Top 0.406: R16.2 31.75,40.64 30.48,39.37 27.94,39.37 27.3,38.73 IC2.12
N$46
  Top 0.406: R17.2 27.94,40.64 24.77,37.47 IC2.14
N$47  (via drill 0.35)
  Top 0.406: R18.2 33.02,44.45 v27.94,44.45 | IC2.16 22.23,38.73 23.5,40.01 v23.5,41.27
  Bottom 0.406: v27.94,44.45 24.13,44.45 23.5,43.81 v23.5,41.27
N$48
  Top 0.406: IC2.18 19.68,38.1 19.68,38.73 19.68,41.27 21.59,43.18 24.13,43.18 25.4,41.91 R19.2
N$49  (via drill 0.35)
  Top 0.203: JP3.2 35.56,2.54 36.83,3.81 43.18,3.81 45.72,6.35 v45.72,7.62 | U$1.64 46.34,12.08 v46.99,11.43
  Top 0.406: R26.1 26.67,3.81 27.94,5.08 30.48,5.08 31.75,3.81 JP3.2
  Bottom 0.203: v45.72,7.62 45.72,10.16 v46.99,11.43
N$50
  Top 0.406: R24.1 T10.2
N$51
  Bottom 0.203: T10.3 34.29,33.02 34.29,23.5 R25.1
N$52
  Top 0.203: R24.2 36.83,25.4 38.16,24.07 U$1.32
N$53
  Top 0.406: JP2.1 R25.2
N$54
  Top 0.406: B7.2 B8.1
N$55
  Top 0.406: B1.2 B2.1
N$56
  Top 0.406: B2.2 B3.1
N$57
  Top 0.406: B4.2 B5.1
N$58
  Top 0.406: B5.2 B6.1
N$59
  Top 0.406: B8.2 B9.1
N$60
  Top 0.406: B11.2 B10.1
N$61
  Top 0.406: B10.2 B12.1
PGC
  Top 0.203: U$1.16 49.47,21.53 50.8,22.86 JP1.5
PGD
  Top 0.203: JP1.4 53.9,21.03 U$1.15
ROW_1  (via drill 0.35)
  Top 0.203: U$1.8 45.34,17.53 44.45,18.41 v44.45,19.05 | v55.88,48.9 57.15,50.16 58.42,50.16 59.05,49.53 B1.1 | v46.99,26.04 48.26,27.3 48.26,29.21 49.53,30.48 54.61,30.48 55.88,31.75 55.88,34.29 v55.88,45.09
  Bottom 0.203: v44.45,19.05 44.45,23.5 v46.99,26.04 | v55.88,45.09 v55.88,48.9
ROW_2  (via drill 0.35)
  Top 0.152: 57.88,37.56 B4.1
  Top 0.203: v52.07,19.05 55.88,19.05 56.52,19.68 56.52,36.2 57.88,37.56 | U$1.6 48.28,16.53 49.53,17.78 v50.8,17.78
  Bottom 0.203: v50.8,17.78 v52.07,19.05
ROW_3  (via drill 0.35)
  Top 0.203: B7.1 57.15,24.23 57.15,17.14 v56.52,16.51 | U$1.5 49.05,16.03 49.53,16.51 v50.8,16.51
  Bottom 0.203: v50.8,16.51 v56.52,16.51
ROW_4  (via drill 0.35)
  Top 0.203: U$1.4 49.24,15.53 v49.53,15.24 | v57.78,13.34 58.42,13.34 59.05,13.96 B11.1
  Bottom 0.203: v49.53,15.24 50.8,13.97 57.15,13.97 v57.78,13.34
VCC  (via drill 0.35)
  Top 0.203: U$1.57 42.16,10.41 41.91,10.16 | 41.91,10.16 C4.1 | C1.1 45.72,10.16 41.91,10.16 | C1.1 49.53,8.89 52.07,11.43 52.07,13.97 | R23.1 45.72,2.54 46.99,3.81 C1.1 | 52.07,13.97 52.07,17.78 51.32,18.53 U$1.10 | JP1.2 53.34,15.24 52.07,13.97 | U$1.26 41.16,22.11 v40.64,21.59 | C5.1 31.77,19.03 U$1.38 | U$1.19 44.66,27.52 C3.1
  Top 0.406: 44.45,35.56 43.81,36.2 IC1.24 | C10.1 44.45,35.56 | IC1.1 45.09,36.2 44.45,35.56
  Top 0.762: USB_CONN1.VBUS 16.18,15.57 C8.+ | C8.+ JP2.2 12.7,22.86 11.43,24.13 11.43,31.75 | C8.+ 19.05,15.24 | 19.05,15.24 22.86,19.05 C6.+ 27.94,19.05 | 27.94,19.05 C5.1 | R26.2 19.05,5.08 19.05,6.99 | 19.05,6.99 19.05,15.24 | C4.1 29.21,10.16 27.94,11.43 27.94,19.05 | C10.1 45.72,31.75 C3.1 | IC2.20 14.55,36.78 13.97,36.2 C9.1 12.7,34.29 11.43,33.02 11.43,31.75 | TP1.TP 19.05,6.99 | TP2.TP 11.43,31.75
  Bottom 0.203: v40.64,21.59 40.64,24.13 C2.1
  Bottom 0.762: C5.1 34.29,19.05 35.56,20.32 C2.1 38.1,29.21 41.91,33.02 C10.1

### Text on the board
tNames: Premium v.2 | 1 | 2 | 3 | 4 | 5 | 6 | buzz. | 7 | 8 | 9 | prog. | therm. | / N | 0 | / Y | QB | 2018
bNames: WARNING: contains prime numbers. Handle with care